# Vivado block design bd_afc3, xczu48dr-ffvg1517-2-e, Vivado 2024.1
# (continued, part 5 of 22)
current_bd_instance /s00_entry_pipeline
set_property -dict [list \
  CONFIG.ADDR_WIDTH 40 \
  CONFIG.ENABLE_PIPELINING 0 \
  CONFIG.ID_WIDTH 16 \
  CONFIG.IS_CASCADED 0 \
  CONFIG.MSC000_ROUTE 0b1000000100000001 \
  CONFIG.MSC001_ROUTE 0b1000001000000001 \
  CONFIG.MSC002_ROUTE 0b1000010000000001 \
  CONFIG.MSC003_ROUTE 0b1000100000000001 \
  CONFIG.MSC004_ROUTE 0b1001000000000001 \
  CONFIG.MSC005_ROUTE 0b1010000000000001 \
  CONFIG.MSC006_ROUTE 0b1100000000000001 \
  CONFIG.MSC007_ROUTE 0b1000000100000010 \
  CONFIG.MSC008_ROUTE 0b1000001000000010 \
  CONFIG.MSC009_ROUTE 0b1000010000000010 \
  CONFIG.MSC010_ROUTE 0b1000100000000010 \
  CONFIG.MSC011_ROUTE 0b1001000000000010 \
  CONFIG.MSC012_ROUTE 0b1010000000000010 \
  CONFIG.MSC013_ROUTE 0b1100000000000010 \
  CONFIG.MSC014_ROUTE 0b1000000100000100 \
  CONFIG.MSC015_ROUTE 0b1000001000000100 \
  CONFIG.MSC016_ROUTE 0b1000010000000100 \
  CONFIG.MSC017_ROUTE 0b1000100000000100 \
  CONFIG.MSC018_ROUTE 0b1001000000000100 \
  CONFIG.MSC019_ROUTE 0b1010000000000100 \
  CONFIG.MSC020_ROUTE 0b1100000000000100 \
  CONFIG.MSC021_ROUTE 0b1000000100001000 \
  CONFIG.MSC022_ROUTE 0b1000001000001000 \
  CONFIG.MSC023_ROUTE 0b1000010000001000 \
  CONFIG.MSC024_ROUTE 0b1000100000001000 \
  CONFIG.MSC025_ROUTE 0b1001000000001000 \
  CONFIG.MSC026_ROUTE 0b1010000000001000 \
  CONFIG.MSC027_ROUTE 0b1000000100010000 \
  CONFIG.MSC028_ROUTE 0b1000001000010000 \
  CONFIG.MSC029_ROUTE 0b1000010000010000 \
  CONFIG.MSC030_ROUTE 0b1000100000010000 \
  CONFIG.MSC031_ROUTE 0b1001000000010000 \
  CONFIG.MSC032_ROUTE 0b1010000000010000 \
  CONFIG.MSC033_ROUTE 0b1000000100100000 \
  CONFIG.MSC034_ROUTE 0b1000001000100000 \
  CONFIG.MSC035_ROUTE 0b1000010000100000 \
  CONFIG.MSC036_ROUTE 0b1000100000100000 \
  CONFIG.MSC037_ROUTE 0b1001000000100000 \
  CONFIG.MSC038_ROUTE 0b1010000000100000 \
  CONFIG.MSC039_ROUTE 0b1000000101000000 \
  CONFIG.MSC040_ROUTE 0b1000001001000000 \
  CONFIG.MSC041_ROUTE 0b1000010001000000 \
  CONFIG.MSC042_ROUTE 0b1000100001000000 \
  CONFIG.MSC043_ROUTE 0b1001000001000000 \
  CONFIG.MSC044_ROUTE 0b1010000001000000 \
  CONFIG.MSC045_ROUTE 0b1000000110000000 \
  CONFIG.MSC046_ROUTE 0b1000001010000000 \
  CONFIG.MSC047_ROUTE 0b1000010010000000 \
  CONFIG.MSC048_ROUTE 0b1000100010000000 \
  CONFIG.MSC049_ROUTE 0b1001000010000000 \
  CONFIG.MSC050_ROUTE 0b1010000010000000 \
  CONFIG.MSC_ROUTE_WIDTH 16 \
  CONFIG.NUM_MSC 51 \
  CONFIG.NUM_READ_OUTSTANDING 8 \
  CONFIG.NUM_SEG 51 \
  CONFIG.NUM_WRITE_OUTSTANDING 8 \
  CONFIG.RDATA_WIDTH 32 \
  CONFIG.READ_WRITE_MODE READ_WRITE \
  CONFIG.SEG000_BASE_ADDR 0x0000000080000000 \
  CONFIG.SEG000_SECURE_READ 0 \
  CONFIG.SEG000_SECURE_WRITE 0 \
  CONFIG.SEG000_SEP_ROUTE 0b0000000000000000000000000000000000000000000000000000000000000000 \
  CONFIG.SEG000_SIZE 13 \
  CONFIG.SEG000_SUPPORTS_READ 1 \
  CONFIG.SEG000_SUPPORTS_WRITE 1 \
  CONFIG.SEG001_BASE_ADDR 0x0000000080010000 \
  CONFIG.SEG001_SECURE_READ 0 \
  CONFIG.SEG001_SECURE_WRITE 0 \
  CONFIG.SEG001_SEP_ROUTE 0b0000000000000000000000000000000000000000000000000000000000001100 \
  CONFIG.SEG001_SIZE 16 \
  CONFIG.SEG001_SUPPORTS_READ 1 \
  CONFIG.SEG001_SUPPORTS_WRITE 1 \
  CONFIG.SEG002_BASE_ADDR 0x0000000080020000 \
  CONFIG.SEG002_SECURE_READ 0 \
  CONFIG.SEG002_SECURE_WRITE 0 \
  CONFIG.SEG002_SEP_ROUTE 0b0000000000000000000000000000000000000000000000000000000000001101 \
  CONFIG.SEG002_SIZE 16 \
  CONFIG.SEG002_SUPPORTS_READ 1 \
  CONFIG.SEG002_SUPPORTS_WRITE 1 \
  CONFIG.SEG003_BASE_ADDR 0x0000000080030000 \
  CONFIG.SEG003_SECURE_READ 0 \
  CONFIG.SEG003_SECURE_WRITE 0 \
  CONFIG.SEG003_SEP_ROUTE 0b0000000000000000000000000000000000000000000000000000000000001110 \
  CONFIG.SEG003_SIZE 16 \
  CONFIG.SEG003_SUPPORTS_READ 1 \
  CONFIG.SEG003_SUPPORTS_WRITE 1 \
  CONFIG.SEG004_BASE_ADDR 0x0000000080040000 \
  CONFIG.SEG004_SECURE_READ 0 \
  CONFIG.SEG004_SECURE_WRITE 0 \
  CONFIG.SEG004_SEP_ROUTE 0b0000000000000000000000000000000000000000000000000000000000001111 \
  CONFIG.SEG004_SIZE 16 \
  CONFIG.SEG004_SUPPORTS_READ 1 \
  CONFIG.SEG004_SUPPORTS_WRITE 1 \
  CONFIG.SEG005_BASE_ADDR 0x0000000080050000 \
  CONFIG.SEG005_SECURE_READ 0 \
  CONFIG.SEG005_SECURE_WRITE 0 \
  CONFIG.SEG005_SEP_ROUTE 0b0000000000000000000000000000000000000000000000000000000000010000 \
  CONFIG.SEG005_SIZE 16 \
  CONFIG.SEG005_SUPPORTS_READ 1 \
  CONFIG.SEG005_SUPPORTS_WRITE 1 \
  CONFIG.SEG006_BASE_ADDR 0x0000000080060000 \
  CONFIG.SEG006_SECURE_READ 0 \
  CONFIG.SEG006_SECURE_WRITE 0 \
  CONFIG.SEG006_SEP_ROUTE 0b0000000000000000000000000000000000000000000000000000000000010001 \
  CONFIG.SEG006_SIZE 16 \
  CONFIG.SEG006_SUPPORTS_READ 1 \
  CONFIG.SEG006_SUPPORTS_WRITE 1 \
  CONFIG.SEG007_BASE_ADDR 0x0000000080070000 \
  CONFIG.SEG007_SECURE_READ 0 \
  CONFIG.SEG007_SECURE_WRITE 0 \
  CONFIG.SEG007_SEP_ROUTE 0b0000000000000000000000000000000000000000000000000000000000010010 \
  CONFIG.SEG007_SIZE 16 \
  CONFIG.SEG007_SUPPORTS_READ 1 \
  CONFIG.SEG007_SUPPORTS_WRITE 1 \
  CONFIG.SEG008_BASE_ADDR 0x0000000080080000 \
  CONFIG.SEG008_SECURE_READ 0 \
  CONFIG.SEG008_SECURE_WRITE 0 \
  CONFIG.SEG008_SEP_ROUTE 0b0000000000000000000000000000000000000000000000000000000000010011 \
  CONFIG.SEG008_SIZE 16 \
  CONFIG.SEG008_SUPPORTS_READ 1 \
  CONFIG.SEG008_SUPPORTS_WRITE 1 \
  CONFIG.SEG009_BASE_ADDR 0x0000000080090000 \
  CONFIG.SEG009_SECURE_READ 0 \
  CONFIG.SEG009_SECURE_WRITE 0 \
  CONFIG.SEG009_SEP_ROUTE 0b0000000000000000000000000000000000000000000000000000000000010100 \
  CONFIG.SEG009_SIZE 16 \
  CONFIG.SEG009_SUPPORTS_READ 1 \
  CONFIG.SEG009_SUPPORTS_WRITE 1 \
  CONFIG.SEG010_BASE_ADDR 0x00000000800A0000 \
  CONFIG.SEG010_SECURE_READ 0 \
  CONFIG.SEG010_SECURE_WRITE 0 \
  CONFIG.SEG010_SEP_ROUTE 0b0000000000000000000000000000000000000000000000000000000000010101 \
  CONFIG.SEG010_SIZE 16 \
  CONFIG.SEG010_SUPPORTS_READ 1 \
  CONFIG.SEG010_SUPPORTS_WRITE 1 \
  CONFIG.SEG011_BASE_ADDR 0x00000000800B0000 \
  CONFIG.SEG011_SECURE_READ 0 \
  CONFIG.SEG011_SECURE_WRITE 0 \
  CONFIG.SEG011_SEP_ROUTE 0b0000000000000000000000000000000000000000000000000000000000010110 \
  CONFIG.SEG011_SIZE 16 \
  CONFIG.SEG011_SUPPORTS_READ 1 \
  CONFIG.SEG011_SUPPORTS_WRITE 1 \
  CONFIG.SEG012_BASE_ADDR 0x00000000800C0000 \
  CONFIG.SEG012_SECURE_READ 0 \
  CONFIG.SEG012_SECURE_WRITE 0 \
  CONFIG.SEG012_SEP_ROUTE 0b0000000000000000000000000000000000000000000000000000000000010111 \
  CONFIG.SEG012_SIZE 16 \
  CONFIG.SEG012_SUPPORTS_READ 1 \
  CONFIG.SEG012_SUPPORTS_WRITE 1 \
  CONFIG.SEG013_BASE_ADDR 0x00000000800D0000 \
  CONFIG.SEG013_SECURE_READ 0 \
  CONFIG.SEG013_SECURE_WRITE 0 \
  CONFIG.SEG013_SEP_ROUTE 0b0000000000000000000000000000000000000000000000000000000000011000 \
  CONFIG.SEG013_SIZE 16 \
  CONFIG.SEG013_SUPPORTS_READ 1 \
  CONFIG.SEG013_SUPPORTS_WRITE 1 \
  CONFIG.SEG014_BASE_ADDR 0x00000000800E0000 \
  CONFIG.SEG014_SECURE_READ 0 \
  CONFIG.SEG014_SECURE_WRITE 0 \
  CONFIG.SEG014_SEP_ROUTE 0b0000000000000000000000000000000000000000000000000000000000011001 \
  CONFIG.SEG014_SIZE 16 \
  CONFIG.SEG014_SUPPORTS_READ 1 \
  CONFIG.SEG014_SUPPORTS_WRITE 1 \
  CONFIG.SEG015_BASE_ADDR 0x00000000800F0000 \
  CONFIG.SEG015_SECURE_READ 0 \
  CONFIG.SEG015_SECURE_WRITE 0 \
  CONFIG.SEG015_SEP_ROUTE 0b0000000000000000000000000000000000000000000000000000000000011010 \
  CONFIG.SEG015_SIZE 16 \
  CONFIG.SEG015_SUPPORTS_READ 1 \
  CONFIG.SEG015_SUPPORTS_WRITE 1 \
  CONFIG.SEG016_BASE_ADDR 0x0000000080100000 \
  CONFIG.SEG016_SECURE_READ 0 \
  CONFIG.SEG016_SECURE_WRITE 0 \
  CONFIG.SEG016_SEP_ROUTE 0b0000000000000000000000000000000000000000000000000000000000011011 \
  CONFIG.SEG016_SIZE 16 \
  CONFIG.SEG016_SUPPORTS_READ 1 \
  CONFIG.SEG016_SUPPORTS_WRITE 1 \
  CONFIG.SEG017_BASE_ADDR 0x0000000080110000 \
  CONFIG.SEG017_SECURE_READ 0 \
  CONFIG.SEG017_SECURE_WRITE 0 \
  CONFIG.SEG017_SEP_ROUTE 0b0000000000000000000000000000000000000000000000000000000000011100 \
  CONFIG.SEG017_SIZE 16 \
  CONFIG.SEG017_SUPPORTS_READ 1 \
  CONFIG.SEG017_SUPPORTS_WRITE 1 \
  CONFIG.SEG018_BASE_ADDR 0x0000000080120000 \
  CONFIG.SEG018_SECURE_READ 0 \
  CONFIG.SEG018_SECURE_WRITE 0 \
  CONFIG.SEG018_SEP_ROUTE 0b0000000000000000000000000000000000000000000000000000000000011101 \
  CONFIG.SEG018_SIZE 16 \
  CONFIG.SEG018_SUPPORTS_READ 1 \
  CONFIG.SEG018_SUPPORTS_WRITE 1 \
  CONFIG.SEG019_BASE_ADDR 0x0000000080130000 \
  CONFIG.SEG019_SECURE_READ 0 \
  CONFIG.SEG019_SECURE_WRITE 0 \
  CONFIG.SEG019_SEP_ROUTE 0b0000000000000000000000000000000000000000000000000000000000011110 \
  CONFIG.SEG019_SIZE 16 \
  CONFIG.SEG019_SUPPORTS_READ 1 \
  CONFIG.SEG019_SUPPORTS_WRITE 1 \
  CONFIG.SEG020_BASE_ADDR 0x0000000080140000 \
  CONFIG.SEG020_SECURE_READ 0 \
  CONFIG.SEG020_SECURE_WRITE 0 \
  CONFIG.SEG020_SEP_ROUTE 0b0000000000000000000000000000000000000000000000000000000000011111 \
  CONFIG.SEG020_SIZE 16 \
  CONFIG.SEG020_SUPPORTS_READ 1 \
  CONFIG.SEG020_SUPPORTS_WRITE 1 \
  CONFIG.SEG021_BASE_ADDR 0x0000000080150000 \
  CONFIG.SEG021_SECURE_READ 0 \
  CONFIG.SEG021_SECURE_WRITE 0 \
  CONFIG.SEG021_SEP_ROUTE 0b0000000000000000000000000000000000000000000000000000000000100000 \
  CONFIG.SEG021_SIZE 16 \
  CONFIG.SEG021_SUPPORTS_READ 1 \
  CONFIG.SEG021_SUPPORTS_WRITE 1 \
  CONFIG.SEG022_BASE_ADDR 0x0000000080160000 \
  CONFIG.SEG022_SECURE_READ 0 \
  CONFIG.SEG022_SECURE_WRITE 0 \
  CONFIG.SEG022_SEP_ROUTE 0b0000000000000000000000000000000000000000000000000000000000100001 \
  CONFIG.SEG022_SIZE 16 \
  CONFIG.SEG022_SUPPORTS_READ 1 \
  CONFIG.SEG022_SUPPORTS_WRITE 1 \
  CONFIG.SEG023_BASE_ADDR 0x0000000080170000 \
  CONFIG.SEG023_SECURE_READ 0 \
  CONFIG.SEG023_SECURE_WRITE 0 \
  CONFIG.SEG023_SEP_ROUTE 0b0000000000000000000000000000000000000000000000000000000000100010 \
  CONFIG.SEG023_SIZE 16 \
  CONFIG.SEG023_SUPPORTS_READ 1 \
  CONFIG.SEG023_SUPPORTS_WRITE 1 \
  CONFIG.SEG024_BASE_ADDR 0x0000000080180000 \
  CONFIG.SEG024_SECURE_READ 0 \
  CONFIG.SEG024_SECURE_WRITE 0 \
  CONFIG.SEG024_SEP_ROUTE 0b0000000000000000000000000000000000000000000000000000000000100011 \
  CONFIG.SEG024_SIZE 16 \
  CONFIG.SEG024_SUPPORTS_READ 1 \
  CONFIG.SEG024_SUPPORTS_WRITE 1 \
  CONFIG.SEG025_BASE_ADDR 0x0000000080190000 \
  CONFIG.SEG025_SECURE_READ 0 \
  CONFIG.SEG025_SECURE_WRITE 0 \
  CONFIG.SEG025_SEP_ROUTE 0b0000000000000000000000000000000000000000000000000000000000100100 \
  CONFIG.SEG025_SIZE 16 \
  CONFIG.SEG025_SUPPORTS_READ 1 \
  CONFIG.SEG025_SUPPORTS_WRITE 1 \
  CONFIG.SEG026_BASE_ADDR 0x00000000801A0000 \
  CONFIG.SEG026_SECURE_READ 0 \
  CONFIG.SEG026_SECURE_WRITE 0 \
  CONFIG.SEG026_SEP_ROUTE 0b0000000000000000000000000000000000000000000000000000000000100101 \
  CONFIG.SEG026_SIZE 16 \
  CONFIG.SEG026_SUPPORTS_READ 1 \
  CONFIG.SEG026_SUPPORTS_WRITE 1 \
  CONFIG.SEG027_BASE_ADDR 0x00000000801B0000 \
  CONFIG.SEG027_SECURE_READ 0 \
  CONFIG.SEG027_SECURE_WRITE 0 \
  CONFIG.SEG027_SEP_ROUTE 0b0000000000000000000000000000000000000000000000000000000000100110 \
  CONFIG.SEG027_SIZE 16 \
  CONFIG.SEG027_SUPPORTS_READ 1 \
  CONFIG.SEG027_SUPPORTS_WRITE 1 \
  CONFIG.SEG028_BASE_ADDR 0x00000000801C0000 \
  CONFIG.SEG028_SECURE_READ 0 \
  CONFIG.SEG028_SECURE_WRITE 0 \
  CONFIG.SEG028_SEP_ROUTE 0b0000000000000000000000000000000000000000000000000000000000100111 \
  CONFIG.SEG028_SIZE 16 \
  CONFIG.SEG028_SUPPORTS_READ 1 \
  CONFIG.SEG028_SUPPORTS_WRITE 1 \
  CONFIG.SEG029_BASE_ADDR 0x00000000801D0000 \
  CONFIG.SEG029_SECURE_READ 0 \
  CONFIG.SEG029_SECURE_WRITE 0 \
  CONFIG.SEG029_SEP_ROUTE 0b0000000000000000000000000000000000000000000000000000000000101000 \
  CONFIG.SEG029_SIZE 16 \
  CONFIG.SEG029_SUPPORTS_READ 1 \
  CONFIG.SEG029_SUPPORTS_WRITE 1 \
  CONFIG.SEG030_BASE_ADDR 0x00000000801E0000 \
  CONFIG.SEG030_SECURE_READ 0 \
  CONFIG.SEG030_SECURE_WRITE 0 \
  CONFIG.SEG030_SEP_ROUTE 0b0000000000000000000000000000000000000000000000000000000000101001 \
  CONFIG.SEG030_SIZE 16 \
  CONFIG.SEG030_SUPPORTS_READ 1 \
  CONFIG.SEG030_SUPPORTS_WRITE 1 \
  CONFIG.SEG031_BASE_ADDR 0x00000000801F0000 \
  CONFIG.SEG031_SECURE_READ 0 \
  CONFIG.SEG031_SECURE_WRITE 0 \
  CONFIG.SEG031_SEP_ROUTE 0b0000000000000000000000000000000000000000000000000000000000101010 \
  CONFIG.SEG031_SIZE 16 \
  CONFIG.SEG031_SUPPORTS_READ 1 \
  CONFIG.SEG031_SUPPORTS_WRITE 1 \
  CONFIG.SEG032_BASE_ADDR 0x0000000080200000 \
  CONFIG.SEG032_SECURE_READ 0 \
  CONFIG.SEG032_SECURE_WRITE 0 \
  CONFIG.SEG032_SEP_ROUTE 0b0000000000000000000000000000000000000000000000000000000000101011 \
  CONFIG.SEG032_SIZE 16 \
  CONFIG.SEG032_SUPPORTS_READ 1 \
  CONFIG.SEG032_SUPPORTS_WRITE 1 \
  CONFIG.SEG033_BASE_ADDR 0x0000000080210000 \
  CONFIG.SEG033_SECURE_READ 0 \
  CONFIG.SEG033_SECURE_WRITE 0 \
  CONFIG.SEG033_SEP_ROUTE 0b0000000000000000000000000000000000000000000000000000000000101100 \
  CONFIG.SEG033_SIZE 16 \
  CONFIG.SEG033_SUPPORTS_READ 1 \
  CONFIG.SEG033_SUPPORTS_WRITE 1 \
  CONFIG.SEG034_BASE_ADDR 0x0000000080220000 \
  CONFIG.SEG034_SECURE_READ 0 \
  CONFIG.SEG034_SECURE_WRITE 0 \
  CONFIG.SEG034_SEP_ROUTE 0b0000000000000000000000000000000000000000000000000000000000101101 \
  CONFIG.SEG034_SIZE 16 \
  CONFIG.SEG034_SUPPORTS_READ 1 \
  CONFIG.SEG034_SUPPORTS_WRITE 1 \
  CONFIG.SEG035_BASE_ADDR 0x0000000080230000 \
  CONFIG.SEG035_SECURE_READ 0 \
  CONFIG.SEG035_SECURE_WRITE 0 \
  CONFIG.SEG035_SEP_ROUTE 0b0000000000000000000000000000000000000000000000000000000000101110 \
  CONFIG.SEG035_SIZE 16 \
  CONFIG.SEG035_SUPPORTS_READ 1 \
  CONFIG.SEG035_SUPPORTS_WRITE 1 \
  CONFIG.SEG036_BASE_ADDR 0x0000000080240000 \
  CONFIG.SEG036_SECURE_READ 0 \
  CONFIG.SEG036_SECURE_WRITE 0 \
  CONFIG.SEG036_SEP_ROUTE 0b0000000000000000000000000000000000000000000000000000000000101111 \
  CONFIG.SEG036_SIZE 16 \
  CONFIG.SEG036_SUPPORTS_READ 1 \
  CONFIG.SEG036_SUPPORTS_WRITE 1 \
  CONFIG.SEG037_BASE_ADDR 0x0000000080250000 \
  CONFIG.SEG037_SECURE_READ 0 \
  CONFIG.SEG037_SECURE_WRITE 0 \
  CONFIG.SEG037_SEP_ROUTE 0b0000000000000000000000000000000000000000000000000000000000110000 \
  CONFIG.SEG037_SIZE 16 \
  CONFIG.SEG037_SUPPORTS_READ 1 \
  CONFIG.SEG037_SUPPORTS_WRITE 1 \
  CONFIG.SEG038_BASE_ADDR 0x0000000080260000 \
  CONFIG.SEG038_SECURE_READ 0 \
  CONFIG.SEG038_SECURE_WRITE 0 \
  CONFIG.SEG038_SEP_ROUTE 0b0000000000000000000000000000000000000000000000000000000000110001 \
  CONFIG.SEG038_SIZE 16 \
  CONFIG.SEG038_SUPPORTS_READ 1 \
  CONFIG.SEG038_SUPPORTS_WRITE 1 \
  CONFIG.SEG039_BASE_ADDR 0x0000000080270000 \
  CONFIG.SEG039_SECURE_READ 0 \
  CONFIG.SEG039_SECURE_WRITE 0 \
  CONFIG.SEG039_SEP_ROUTE 0b0000000000000000000000000000000000000000000000000000000000110010 \
  CONFIG.SEG039_SIZE 16 \
  CONFIG.SEG039_SUPPORTS_READ 1 \
  CONFIG.SEG039_SUPPORTS_WRITE 1 \
  CONFIG.SEG040_BASE_ADDR 0x0000000082000000 \
  CONFIG.SEG040_SECURE_READ 0 \
  CONFIG.SEG040_SECURE_WRITE 0 \
  CONFIG.SEG040_SEP_ROUTE 0b0000000000000000000000000000000000000000000000000000000000000001 \
  CONFIG.SEG040_SIZE 13 \
  CONFIG.SEG040_SUPPORTS_READ 1 \
  CONFIG.SEG040_SUPPORTS_WRITE 1 \
  CONFIG.SEG041_BASE_ADDR 0x0000000084000000 \
  CONFIG.SEG041_SECURE_READ 0 \
  CONFIG.SEG041_SECURE_WRITE 0 \
  CONFIG.SEG041_SEP_ROUTE 0b0000000000000000000000000000000000000000000000000000000000000010 \
  CONFIG.SEG041_SIZE 13 \
  CONFIG.SEG041_SUPPORTS_READ 1 \
  CONFIG.SEG041_SUPPORTS_WRITE 1 \
  CONFIG.SEG042_BASE_ADDR 0x0000000086000000 \
  CONFIG.SEG042_SECURE_READ 0 \
  CONFIG.SEG042_SECURE_WRITE 0 \
  CONFIG.SEG042_SEP_ROUTE 0b0000000000000000000000000000000000000000000000000000000000000011 \
  CONFIG.SEG042_SIZE 13 \
  CONFIG.SEG042_SUPPORTS_READ 1 \
  CONFIG.SEG042_SUPPORTS_WRITE 1 \
  CONFIG.SEG043_BASE_ADDR 0x0000000088000000 \
  CONFIG.SEG043_SECURE_READ 0 \
  CONFIG.SEG043_SECURE_WRITE 0 \
  CONFIG.SEG043_SEP_ROUTE 0b0000000000000000000000000000000000000000000000000000000000000100 \
  CONFIG.SEG043_SIZE 13 \
  CONFIG.SEG043_SUPPORTS_READ 1 \
  CONFIG.SEG043_SUPPORTS_WRITE 1 \
  CONFIG.SEG044_BASE_ADDR 0x000000008A000000 \
  CONFIG.SEG044_SECURE_READ 0 \
  CONFIG.SEG044_SECURE_WRITE 0 \
  CONFIG.SEG044_SEP_ROUTE 0b0000000000000000000000000000000000000000000000000000000000000101 \
  CONFIG.SEG044_SIZE 13 \
  CONFIG.SEG044_SUPPORTS_READ 1 \
  CONFIG.SEG044_SUPPORTS_WRITE 1 \
  CONFIG.SEG045_BASE_ADDR 0x000000008C000000 \
  CONFIG.SEG045_SECURE_READ 0 \
  CONFIG.SEG045_SECURE_WRITE 0 \
  CONFIG.SEG045_SEP_ROUTE 0b0000000000000000000000000000000000000000000000000000000000000110 \
  CONFIG.SEG045_SIZE 13 \
  CONFIG.SEG045_SUPPORTS_READ 1 \
  CONFIG.SEG045_SUPPORTS_WRITE 1 \
  CONFIG.SEG046_BASE_ADDR 0x000000008E000000 \
  CONFIG.SEG046_SECURE_READ 0 \
  CONFIG.SEG046_SECURE_WRITE 0 \
  CONFIG.SEG046_SEP_ROUTE 0b0000000000000000000000000000000000000000000000000000000000000111 \
  CONFIG.SEG046_SIZE 13 \
  CONFIG.SEG046_SUPPORTS_READ 1 \
  CONFIG.SEG046_SUPPORTS_WRITE 1 \
  CONFIG.SEG047_BASE_ADDR 0x0000000090000000 \
  CONFIG.SEG047_SECURE_READ 0 \
  CONFIG.SEG047_SECURE_WRITE 0 \
  CONFIG.SEG047_SEP_ROUTE 0b0000000000000000000000000000000000000000000000000000000000001000 \
  CONFIG.SEG047_SIZE 13 \
  CONFIG.SEG047_SUPPORTS_READ 1 \
  CONFIG.SEG047_SUPPORTS_WRITE 1 \
  CONFIG.SEG048_BASE_ADDR 0x0000000092000000 \
  CONFIG.SEG048_SECURE_READ 0 \
  CONFIG.SEG048_SECURE_WRITE 0 \
  CONFIG.SEG048_SEP_ROUTE 0b0000000000000000000000000000000000000000000000000000000000001001 \
  CONFIG.SEG048_SIZE 13 \
  CONFIG.SEG048_SUPPORTS_READ 1 \
  CONFIG.SEG048_SUPPORTS_WRITE 1 \
  CONFIG.SEG049_BASE_ADDR 0x0000000094000000 \
  CONFIG.SEG049_SECURE_READ 0 \
  CONFIG.SEG049_SECURE_WRITE 0 \
  CONFIG.SEG049_SEP_ROUTE 0b0000000000000000000000000000000000000000000000000000000000001010 \
  CONFIG.SEG049_SIZE 13 \
  CONFIG.SEG049_SUPPORTS_READ 1 \
  CONFIG.SEG049_SUPPORTS_WRITE 1 \
  CONFIG.SEG050_BASE_ADDR 0x0000000096000000 \
  CONFIG.SEG050_SECURE_READ 0 \
  CONFIG.SEG050_SECURE_WRITE 0 \
  CONFIG.SEG050_SEP_ROUTE 0b0000000000000000000000000000000000000000000000000000000000001011 \
  CONFIG.SEG050_SIZE 13 \
  CONFIG.SEG050_SUPPORTS_READ 1 \
  CONFIG.SEG050_SUPPORTS_WRITE 1 \
  CONFIG.SINGLE_ISSUING 1 \
  CONFIG.SUPPORTS_NARROW 1 \
  CONFIG.SUPPORTS_WRAP 0 \
  CONFIG.S_ARUSER_WIDTH 16 \
  CONFIG.S_AWUSER_WIDTH 16 \
  CONFIG.S_BUSER_WIDTH 0 \
  CONFIG.S_PROTOCOL AXI4 \
  CONFIG.S_RUSER_WIDTH 0 \
  CONFIG.S_WUSER_WIDTH 0 \
  CONFIG.WDATA_WIDTH 32 \
] [get_bd_cells s00_mmu]
create_bd_cell -type ip -vlnv xilinx.com:ip:sc_transaction_regulator:1.0 s00_transaction_regulator
set_property -dict [list \
  CONFIG.ADDR_WIDTH 40 \
  CONFIG.IS_CASCADED 0 \
  CONFIG.MEP_IDENTIFIER 1 \
  CONFIG.MEP_IDENTIFIER_WIDTH 1 \
  CONFIG.NUM_READ_OUTSTANDING 8 \
  CONFIG.NUM_READ_THREADS 1 \
  CONFIG.NUM_WRITE_OUTSTANDING 8 \
  CONFIG.NUM_WRITE_THREADS 1 \
  CONFIG.RDATA_WIDTH 32 \
  CONFIG.READ_WRITE_MODE READ_WRITE \
  CONFIG.SEP_ROUTE_WIDTH 6 \
  CONFIG.SINGLE_ISSUING 1 \
  CONFIG.SUPPORTS_READ_DEADLOCK 0 \
  CONFIG.SUPPORTS_WRITE_DEADLOCK 0 \
  CONFIG.S_ID_WIDTH 16 \
  CONFIG.WDATA_WIDTH 32 \
] [get_bd_cells s00_transaction_regulator]
create_bd_cell -type ip -vlnv xilinx.com:ip:sc_si_converter:1.0 s00_si_converter
set_property -dict [list \
  CONFIG.ADDR_WIDTH 40 \
  CONFIG.AXILITE_CONV 1 \
  CONFIG.HAS_BURST 1 \
  CONFIG.ID_WIDTH 3 \
  CONFIG.IS_CASCADED 0 \
  CONFIG.LIMIT_READ_LENGTH 0 \
  CONFIG.LIMIT_WRITE_LENGTH 0 \
  CONFIG.MAX_RUSER_BITS_PER_BYTE 0 \
  CONFIG.MAX_WUSER_BITS_PER_BYTE 0 \
  CONFIG.MEP_IDENTIFIER_WIDTH 1 \
  CONFIG.MSC000_RDATA_WIDTH 32 \
  CONFIG.MSC000_WDATA_WIDTH 32 \
  CONFIG.MSC001_RDATA_WIDTH 32 \
  CONFIG.MSC001_WDATA_WIDTH 32 \
  CONFIG.MSC002_RDATA_WIDTH 32 \
  CONFIG.MSC002_WDATA_WIDTH 32 \
  CONFIG.MSC003_RDATA_WIDTH 32 \
  CONFIG.MSC003_WDATA_WIDTH 32 \
  CONFIG.MSC004_RDATA_WIDTH 32 \
  CONFIG.MSC004_WDATA_WIDTH 32 \
  CONFIG.MSC005_RDATA_WIDTH 32 \
  CONFIG.MSC005_WDATA_WIDTH 32 \
  CONFIG.MSC006_RDATA_WIDTH 32 \
  CONFIG.MSC006_WDATA_WIDTH 32 \
  CONFIG.MSC007_RDATA_WIDTH 32 \
  CONFIG.MSC007_WDATA_WIDTH 32 \
  CONFIG.MSC008_RDATA_WIDTH 32 \
  CONFIG.MSC008_WDATA_WIDTH 32 \
  CONFIG.MSC009_RDATA_WIDTH 32 \
  CONFIG.MSC009_WDATA_WIDTH 32 \
  CONFIG.MSC010_RDATA_WIDTH 32 \
  CONFIG.MSC010_WDATA_WIDTH 32 \
  CONFIG.MSC011_RDATA_WIDTH 32 \
  CONFIG.MSC011_WDATA_WIDTH 32 \
  CONFIG.MSC012_RDATA_WIDTH 32 \
  CONFIG.MSC012_WDATA_WIDTH 32 \
  CONFIG.MSC013_RDATA_WIDTH 32 \
  CONFIG.MSC013_WDATA_WIDTH 32 \
  CONFIG.MSC014_RDATA_WIDTH 32 \
  CONFIG.MSC014_WDATA_WIDTH 32 \
  CONFIG.MSC015_RDATA_WIDTH 32 \
  CONFIG.MSC015_WDATA_WIDTH 32 \
  CONFIG.MSC016_RDATA_WIDTH 32 \
  CONFIG.MSC016_WDATA_WIDTH 32 \
  CONFIG.MSC017_RDATA_WIDTH 32 \
  CONFIG.MSC017_WDATA_WIDTH 32 \
  CONFIG.MSC018_RDATA_WIDTH 32 \
  CONFIG.MSC018_WDATA_WIDTH 32 \
  CONFIG.MSC019_RDATA_WIDTH 32 \
  CONFIG.MSC019_WDATA_WIDTH 32 \
  CONFIG.MSC020_RDATA_WIDTH 32 \
  CONFIG.MSC020_WDATA_WIDTH 32 \
  CONFIG.MSC021_RDATA_WIDTH 32 \
  CONFIG.MSC021_WDATA_WIDTH 32 \
  CONFIG.MSC022_RDATA_WIDTH 32 \
  CONFIG.MSC022_WDATA_WIDTH 32 \
  CONFIG.MSC023_RDATA_WIDTH 32 \
  CONFIG.MSC023_WDATA_WIDTH 32 \
  CONFIG.MSC024_RDATA_WIDTH 32 \
  CONFIG.MSC024_WDATA_WIDTH 32 \
  CONFIG.MSC025_RDATA_WIDTH 32 \
  CONFIG.MSC025_WDATA_WIDTH 32 \
  CONFIG.MSC026_RDATA_WIDTH 32 \
  CONFIG.MSC026_WDATA_WIDTH 32 \
  CONFIG.MSC027_RDATA_WIDTH 32 \
  CONFIG.MSC027_WDATA_WIDTH 32 \
  CONFIG.MSC028_RDATA_WIDTH 32 \
  CONFIG.MSC028_WDATA_WIDTH 32 \
  CONFIG.MSC029_RDATA_WIDTH 32 \
  CONFIG.MSC029_WDATA_WIDTH 32 \
  CONFIG.MSC030_RDATA_WIDTH 32 \
  CONFIG.MSC030_WDATA_WIDTH 32 \
  CONFIG.MSC031_RDATA_WIDTH 32 \
  CONFIG.MSC031_WDATA_WIDTH 32 \
  CONFIG.MSC032_RDATA_WIDTH 32 \
  CONFIG.MSC032_WDATA_WIDTH 32 \
  CONFIG.MSC033_RDATA_WIDTH 32 \
  CONFIG.MSC033_WDATA_WIDTH 32 \
  CONFIG.MSC034_RDATA_WIDTH 32 \
  CONFIG.MSC034_WDATA_WIDTH 32 \
  CONFIG.MSC035_RDATA_WIDTH 32 \
  CONFIG.MSC035_WDATA_WIDTH 32 \
  CONFIG.MSC036_RDATA_WIDTH 32 \
  CONFIG.MSC036_WDATA_WIDTH 32 \
  CONFIG.MSC037_RDATA_WIDTH 32 \
  CONFIG.MSC037_WDATA_WIDTH 32 \
  CONFIG.MSC038_RDATA_WIDTH 32 \
  CONFIG.MSC038_WDATA_WIDTH 32 \
  CONFIG.MSC039_RDATA_WIDTH 32 \
  CONFIG.MSC039_WDATA_WIDTH 32 \
  CONFIG.MSC040_RDATA_WIDTH 32 \
  CONFIG.MSC040_WDATA_WIDTH 32 \
  CONFIG.MSC041_RDATA_WIDTH 32 \
  CONFIG.MSC041_WDATA_WIDTH 32 \
  CONFIG.MSC042_RDATA_WIDTH 32 \
  CONFIG.MSC042_WDATA_WIDTH 32 \
  CONFIG.MSC043_RDATA_WIDTH 32 \
  CONFIG.MSC043_WDATA_WIDTH 32 \
  CONFIG.MSC044_RDATA_WIDTH 32 \
  CONFIG.MSC044_WDATA_WIDTH 32 \
  CONFIG.MSC045_RDATA_WIDTH 32 \
  CONFIG.MSC045_WDATA_WIDTH 32 \
  CONFIG.MSC046_RDATA_WIDTH 32 \
  CONFIG.MSC046_WDATA_WIDTH 32 \
  CONFIG.MSC047_RDATA_WIDTH 32 \
  CONFIG.MSC047_WDATA_WIDTH 32 \
  CONFIG.MSC048_RDATA_WIDTH 32 \
  CONFIG.MSC048_WDATA_WIDTH 32 \
  CONFIG.MSC049_RDATA_WIDTH 32 \
  CONFIG.MSC049_WDATA_WIDTH 32 \
  CONFIG.MSC050_RDATA_WIDTH 32 \
  CONFIG.MSC050_WDATA_WIDTH 32 \
  CONFIG.NUM_MSC 51 \
  CONFIG.NUM_READ_OUTSTANDING 8 \
  CONFIG.NUM_READ_THREADS 1 \
  CONFIG.NUM_SEG 51 \
  CONFIG.NUM_WRITE_OUTSTANDING 8 \
  CONFIG.NUM_WRITE_THREADS 1 \
  CONFIG.RDATA_WIDTH 32 \
  CONFIG.READ_WATERMARK 0 \
  CONFIG.READ_WRITE_MODE READ_WRITE \
  CONFIG.SEP000_PROTOCOL AXI4 \
  CONFIG.SEP000_RDATA_WIDTH 32 \
  CONFIG.SEP000_WDATA_WIDTH 32 \
  CONFIG.SEP001_PROTOCOL AXI4LITE \
  CONFIG.SEP001_RDATA_WIDTH 32 \
  CONFIG.SEP001_WDATA_WIDTH 32 \
  CONFIG.SEP002_PROTOCOL AXI4LITE \
  CONFIG.SEP002_RDATA_WIDTH 32 \
  CONFIG.SEP002_WDATA_WIDTH 32 \
  CONFIG.SEP003_PROTOCOL AXI4LITE \
  CONFIG.SEP003_RDATA_WIDTH 32 \
  CONFIG.SEP003_WDATA_WIDTH 32 \
  CONFIG.SEP004_PROTOCOL AXI4LITE \
  CONFIG.SEP004_RDATA_WIDTH 32 \
  CONFIG.SEP004_WDATA_WIDTH 32 \
  CONFIG.SEP005_PROTOCOL AXI4LITE \
  CONFIG.SEP005_RDATA_WIDTH 32 \
  CONFIG.SEP005_WDATA_WIDTH 32 \
  CONFIG.SEP006_PROTOCOL AXI4LITE \
  CONFIG.SEP006_RDATA_WIDTH 32 \
  CONFIG.SEP006_WDATA_WIDTH 32 \
  CONFIG.SEP007_PROTOCOL AXI4LITE \
  CONFIG.SEP007_RDATA_WIDTH 32 \
  CONFIG.SEP007_WDATA_WIDTH 32 \
  CONFIG.SEP008_PROTOCOL AXI4LITE \
  CONFIG.SEP008_RDATA_WIDTH 32 \
  CONFIG.SEP008_WDATA_WIDTH 32 \
  CONFIG.SEP009_PROTOCOL AXI4LITE \
  CONFIG.SEP009_RDATA_WIDTH 32 \
  CONFIG.SEP009_WDATA_WIDTH 32 \
  CONFIG.SEP010_PROTOCOL AXI4LITE \
  CONFIG.SEP010_RDATA_WIDTH 32 \
  CONFIG.SEP010_WDATA_WIDTH 32 \
  CONFIG.SEP011_PROTOCOL AXI4LITE \
  CONFIG.SEP011_RDATA_WIDTH 32 \
  CONFIG.SEP011_WDATA_WIDTH 32 \
  CONFIG.SEP012_PROTOCOL AXI4LITE \
  CONFIG.SEP012_RDATA_WIDTH 32 \
  CONFIG.SEP012_WDATA_WIDTH 32 \
  CONFIG.SEP013_PROTOCOL AXI4LITE \
  CONFIG.SEP013_RDATA_WIDTH 32 \
  CONFIG.SEP013_WDATA_WIDTH 32 \
  CONFIG.SEP014_PROTOCOL AXI4LITE \
  CONFIG.SEP014_RDATA_WIDTH 32 \
  CONFIG.SEP014_WDATA_WIDTH 32 \
  CONFIG.SEP015_PROTOCOL AXI4LITE \
  CONFIG.SEP015_RDATA_WIDTH 32 \
  CONFIG.SEP015_WDATA_WIDTH 32 \
  CONFIG.SEP016_PROTOCOL AXI4LITE \
  CONFIG.SEP016_RDATA_WIDTH 32 \
  CONFIG.SEP016_WDATA_WIDTH 32 \
  CONFIG.SEP017_PROTOCOL AXI4LITE \
  CONFIG.SEP017_RDATA_WIDTH 32 \
  CONFIG.SEP017_WDATA_WIDTH 32 \
  CONFIG.SEP018_PROTOCOL AXI4LITE \
  CONFIG.SEP018_RDATA_WIDTH 32 \
  CONFIG.SEP018_WDATA_WIDTH 32 \
  CONFIG.SEP019_PROTOCOL AXI4LITE \
  CONFIG.SEP019_RDATA_WIDTH 32 \
  CONFIG.SEP019_WDATA_WIDTH 32 \
  CONFIG.SEP020_PROTOCOL AXI4LITE \
  CONFIG.SEP020_RDATA_WIDTH 32 \
  CONFIG.SEP020_WDATA_WIDTH 32 \
  CONFIG.SEP021_PROTOCOL AXI4LITE \
  CONFIG.SEP021_RDATA_WIDTH 32 \
  CONFIG.SEP021_WDATA_WIDTH 32 \
  CONFIG.SEP022_PROTOCOL AXI4LITE \
  CONFIG.SEP022_RDATA_WIDTH 32 \
  CONFIG.SEP022_WDATA_WIDTH 32 \
  CONFIG.SEP023_PROTOCOL AXI4LITE \
  CONFIG.SEP023_RDATA_WIDTH 32 \
  CONFIG.SEP023_WDATA_WIDTH 32 \
  CONFIG.SEP024_PROTOCOL AXI4LITE \
  CONFIG.SEP024_RDATA_WIDTH 32 \
  CONFIG.SEP024_WDATA_WIDTH 32 \
  CONFIG.SEP025_PROTOCOL AXI4LITE \
  CONFIG.SEP025_RDATA_WIDTH 32 \
  CONFIG.SEP025_WDATA_WIDTH 32 \
  CONFIG.SEP026_PROTOCOL AXI4LITE \
  CONFIG.SEP026_RDATA_WIDTH 32 \
  CONFIG.SEP026_WDATA_WIDTH 32 \
  CONFIG.SEP027_PROTOCOL AXI4LITE \
  CONFIG.SEP027_RDATA_WIDTH 32 \
  CONFIG.SEP027_WDATA_WIDTH 32 \
  CONFIG.SEP028_PROTOCOL AXI4LITE \
  CONFIG.SEP028_RDATA_WIDTH 32 \
  CONFIG.SEP028_WDATA_WIDTH 32 \
  CONFIG.SEP029_PROTOCOL AXI4LITE \
  CONFIG.SEP029_RDATA_WIDTH 32 \
  CONFIG.SEP029_WDATA_WIDTH 32 \
  CONFIG.SEP030_PROTOCOL AXI4LITE \
  CONFIG.SEP030_RDATA_WIDTH 32 \
  CONFIG.SEP030_WDATA_WIDTH 32 \
  CONFIG.SEP031_PROTOCOL AXI4LITE \
  CONFIG.SEP031_RDATA_WIDTH 32 \
  CONFIG.SEP031_WDATA_WIDTH 32 \
  CONFIG.SEP032_PROTOCOL AXI4LITE \
  CONFIG.SEP032_RDATA_WIDTH 32 \
  CONFIG.SEP032_WDATA_WIDTH 32 \
  CONFIG.SEP033_PROTOCOL AXI4LITE \
  CONFIG.SEP033_RDATA_WIDTH 32 \
  CONFIG.SEP033_WDATA_WIDTH 32 \
  CONFIG.SEP034_PROTOCOL AXI4LITE \
  CONFIG.SEP034_RDATA_WIDTH 32 \
  CONFIG.SEP034_WDATA_WIDTH 32 \
  CONFIG.SEP035_PROTOCOL AXI4LITE \
  CONFIG.SEP035_RDATA_WIDTH 32 \
  CONFIG.SEP035_WDATA_WIDTH 32 \
  CONFIG.SEP036_PROTOCOL AXI4LITE \
  CONFIG.SEP036_RDATA_WIDTH 32 \
  CONFIG.SEP036_WDATA_WIDTH 32 \
  CONFIG.SEP037_PROTOCOL AXI4LITE \
  CONFIG.SEP037_RDATA_WIDTH 32 \
  CONFIG.SEP037_WDATA_WIDTH 32 \
  CONFIG.SEP038_PROTOCOL AXI4LITE \
  CONFIG.SEP038_RDATA_WIDTH 32 \
  CONFIG.SEP038_WDATA_WIDTH 32 \
  CONFIG.SEP039_PROTOCOL AXI4LITE \
  CONFIG.SEP039_RDATA_WIDTH 32 \
  CONFIG.SEP039_WDATA_WIDTH 32 \
  CONFIG.SEP040_PROTOCOL AXI4 \
  CONFIG.SEP040_RDATA_WIDTH 32 \
  CONFIG.SEP040_WDATA_WIDTH 32 \
  CONFIG.SEP041_PROTOCOL AXI4 \
  CONFIG.SEP041_RDATA_WIDTH 32 \
  CONFIG.SEP041_WDATA_WIDTH 32 \
  CONFIG.SEP042_PROTOCOL AXI4 \
  CONFIG.SEP042_RDATA_WIDTH 32 \
  CONFIG.SEP042_WDATA_WIDTH 32 \
  CONFIG.SEP043_PROTOCOL AXI4 \
  CONFIG.SEP043_RDATA_WIDTH 32 \
  CONFIG.SEP043_WDATA_WIDTH 32 \
  CONFIG.SEP044_PROTOCOL AXI4 \
  CONFIG.SEP044_RDATA_WIDTH 32 \
  CONFIG.SEP044_WDATA_WIDTH 32 \
  CONFIG.SEP045_PROTOCOL AXI4 \
  CONFIG.SEP045_RDATA_WIDTH 32 \
  CONFIG.SEP045_WDATA_WIDTH 32 \
  CONFIG.SEP046_PROTOCOL AXI4 \
  CONFIG.SEP046_RDATA_WIDTH 32 \
  CONFIG.SEP046_WDATA_WIDTH 32 \
  CONFIG.SEP047_PROTOCOL AXI4 \
  CONFIG.SEP047_RDATA_WIDTH 32 \
  CONFIG.SEP047_WDATA_WIDTH 32 \
  CONFIG.SEP048_PROTOCOL AXI4 \
  CONFIG.SEP048_RDATA_WIDTH 32 \
  CONFIG.SEP048_WDATA_WIDTH 32 \
  CONFIG.SEP049_PROTOCOL AXI4 \
  CONFIG.SEP049_RDATA_WIDTH 32 \
  CONFIG.SEP049_WDATA_WIDTH 32 \
  CONFIG.SEP050_PROTOCOL AXI4 \
  CONFIG.SEP050_RDATA_WIDTH 32 \
  CONFIG.SEP050_WDATA_WIDTH 32 \
  CONFIG.SINGLE_ISSUING 1 \
  CONFIG.SUPPORTS_NARROW 1 \
  CONFIG.S_RUSER_BITS_PER_BYTE 0 \
  CONFIG.S_WUSER_BITS_PER_BYTE 0 \
  CONFIG.WDATA_WIDTH 32 \
  CONFIG.WRITE_WATERMARK 0 \
] [get_bd_cells s00_si_converter]

# ---- hierarchy /s00_nodes ----
current_bd_instance /s00_nodes
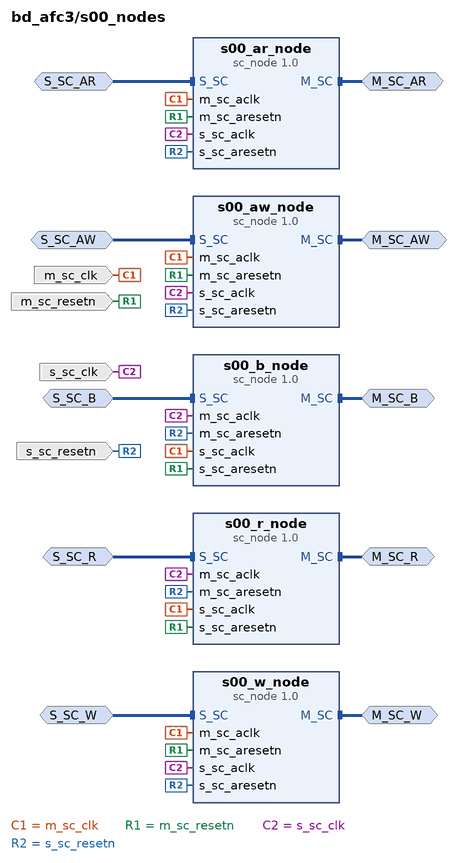
[diagram p31: block diagram inside /s00_nodes]
create_bd_intf_pin -mode Master -vlnv xilinx.com:interface:sc_rtl:1.0 M_SC_AR
create_bd_intf_pin -mode Slave -vlnv xilinx.com:interface:sc_rtl:1.0 S_SC_AR
create_bd_intf_pin -mode Master -vlnv xilinx.com:interface:sc_rtl:1.0 M_SC_R
create_bd_intf_pin -mode Slave -vlnv xilinx.com:interface:sc_rtl:1.0 S_SC_R
create_bd_intf_pin -mode Master -vlnv xilinx.com:interface:sc_rtl:1.0 M_SC_AW
create_bd_intf_pin -mode Slave -vlnv xilinx.com:interface:sc_rtl:1.0 S_SC_AW
create_bd_intf_pin -mode Master -vlnv xilinx.com:interface:sc_rtl:1.0 M_SC_W
create_bd_intf_pin -mode Slave -vlnv xilinx.com:interface:sc_rtl:1.0 S_SC_W
create_bd_intf_pin -mode Master -vlnv xilinx.com:interface:sc_rtl:1.0 M_SC_B
create_bd_intf_pin -mode Slave -vlnv xilinx.com:interface:sc_rtl:1.0 S_SC_B
create_bd_pin -dir I -type clk s_sc_clk
create_bd_pin -dir I -type rst s_sc_resetn
create_bd_pin -dir I -type clk m_sc_clk
create_bd_pin -dir I -type rst m_sc_resetn

create_bd_cell -type ip -vlnv xilinx.com:ip:sc_node:1.0 s00_ar_node
set_property -dict [list \
  CONFIG.ACLKEN_CONVERSION 0 \
  CONFIG.ACLK_RELATIONSHIP 1 \
  CONFIG.ADDR_WIDTH 40 \
  CONFIG.CHANNEL 2 \
  CONFIG.FIFO_TYPE 2 \
  CONFIG.ID_WIDTH 3 \
  CONFIG.M00_NUM_BYTES 4 \
  CONFIG.M01_NUM_BYTES 4 \
  CONFIG.M02_NUM_BYTES 4 \
  CONFIG.M03_NUM_BYTES 4 \
  CONFIG.M04_NUM_BYTES 4 \
  CONFIG.M05_NUM_BYTES 4 \
  CONFIG.M06_NUM_BYTES 4 \
  CONFIG.M07_NUM_BYTES 4 \
  CONFIG.M08_NUM_BYTES 4 \
  CONFIG.M09_NUM_BYTES 4 \
  CONFIG.M10_NUM_BYTES 4 \
  CONFIG.M11_NUM_BYTES 4 \
  CONFIG.M12_NUM_BYTES 4 \
  CONFIG.M13_NUM_BYTES 4 \
  CONFIG.M14_NUM_BYTES 4 \
  CONFIG.M15_NUM_BYTES 4 \
  CONFIG.MAX_PAYLD_BYTES 4 \
  CONFIG.NUM_MI 8 \
  CONFIG.NUM_OUTSTANDING 8 \
  CONFIG.NUM_SI 1 \
  CONFIG.PAYLD_WIDTH 182 \
  CONFIG.S00_NUM_BYTES 4 \
  CONFIG.S01_NUM_BYTES 4 \
  CONFIG.S02_NUM_BYTES 4 \
  CONFIG.S03_NUM_BYTES 4 \
  CONFIG.S04_NUM_BYTES 4 \
  CONFIG.S05_NUM_BYTES 4 \
  CONFIG.S06_NUM_BYTES 4 \
  CONFIG.S07_NUM_BYTES 4 \
  CONFIG.S08_NUM_BYTES 4 \
  CONFIG.S09_NUM_BYTES 4 \
  CONFIG.S10_NUM_BYTES 4 \
  CONFIG.S11_NUM_BYTES 4 \
  CONFIG.S12_NUM_BYTES 4 \
  CONFIG.S13_NUM_BYTES 4 \
  CONFIG.S14_NUM_BYTES 4 \
  CONFIG.S15_NUM_BYTES 4 \
  CONFIG.SC_ROUTE_WIDTH 16 \
  CONFIG.USER_WIDTH 16 \
] [get_bd_cells s00_ar_node]
create_bd_cell -type ip -vlnv xilinx.com:ip:sc_node:1.0 s00_r_node
set_property -dict [list \
  CONFIG.ACLKEN_CONVERSION 0 \
  CONFIG.ACLK_RELATIONSHIP 1 \
  CONFIG.ADDR_WIDTH 40 \
  CONFIG.CHANNEL 0 \
  CONFIG.FIFO_TYPE 2 \
  CONFIG.ID_WIDTH 3 \
  CONFIG.M00_NUM_BYTES 4 \
  CONFIG.M01_NUM_BYTES 4 \
  CONFIG.M02_NUM_BYTES 4 \
  CONFIG.M03_NUM_BYTES 4 \
  CONFIG.M04_NUM_BYTES 4 \
  CONFIG.M05_NUM_BYTES 4 \
  CONFIG.M06_NUM_BYTES 4 \
  CONFIG.M07_NUM_BYTES 4 \
  CONFIG.M08_NUM_BYTES 4 \
  CONFIG.M09_NUM_BYTES 4 \
  CONFIG.M10_NUM_BYTES 4 \
  CONFIG.M11_NUM_BYTES 4 \
  CONFIG.M12_NUM_BYTES 4 \
  CONFIG.M13_NUM_BYTES 4 \
  CONFIG.M14_NUM_BYTES 4 \
  CONFIG.M15_NUM_BYTES 4 \
  CONFIG.MAX_PAYLD_BYTES 4 \
  CONFIG.M_SEND_PIPELINE 0 \
  CONFIG.NUM_MI 1 \
  CONFIG.NUM_OUTSTANDING 8 \
  CONFIG.NUM_SI 8 \
  CONFIG.PAYLD_WIDTH 55 \
  CONFIG.S00_NUM_BYTES 4 \
  CONFIG.S01_NUM_BYTES 4 \
  CONFIG.S02_NUM_BYTES 4 \
  CONFIG.S03_NUM_BYTES 4 \
  CONFIG.S04_NUM_BYTES 4 \
  CONFIG.S05_NUM_BYTES 4 \
  CONFIG.S06_NUM_BYTES 4 \
  CONFIG.S07_NUM_BYTES 4 \
  CONFIG.S08_NUM_BYTES 4 \
  CONFIG.S09_NUM_BYTES 4 \
  CONFIG.S10_NUM_BYTES 4 \
  CONFIG.S11_NUM_BYTES 4 \
  CONFIG.S12_NUM_BYTES 4 \
  CONFIG.S13_NUM_BYTES 4 \
  CONFIG.S14_NUM_BYTES 4 \
  CONFIG.S15_NUM_BYTES 4 \
  CONFIG.SC_ROUTE_WIDTH 3 \
  CONFIG.USER_BITS_PER_BYTE 0 \
] [get_bd_cells s00_r_node]
create_bd_cell -type ip -vlnv xilinx.com:ip:sc_node:1.0 s00_aw_node
set_property -dict [list \
  CONFIG.ACLKEN_CONVERSION 0 \
  CONFIG.ACLK_RELATIONSHIP 1 \
  CONFIG.ADDR_WIDTH 40 \
  CONFIG.CHANNEL 3 \
  CONFIG.FIFO_TYPE 2 \
  CONFIG.ID_WIDTH 3 \
  CONFIG.M00_NUM_BYTES 4 \
  CONFIG.M01_NUM_BYTES 4 \
  CONFIG.M02_NUM_BYTES 4 \
  CONFIG.M03_NUM_BYTES 4 \
  CONFIG.M04_NUM_BYTES 4 \
  CONFIG.M05_NUM_BYTES 4 \
  CONFIG.M06_NUM_BYTES 4 \
  CONFIG.M07_NUM_BYTES 4 \
  CONFIG.M08_NUM_BYTES 4 \
  CONFIG.M09_NUM_BYTES 4 \
  CONFIG.M10_NUM_BYTES 4 \
  CONFIG.M11_NUM_BYTES 4 \
  CONFIG.M12_NUM_BYTES 4 \
  CONFIG.M13_NUM_BYTES 4 \
  CONFIG.M14_NUM_BYTES 4 \
  CONFIG.M15_NUM_BYTES 4 \
  CONFIG.MAX_PAYLD_BYTES 4 \
  CONFIG.NUM_MI 8 \
  CONFIG.NUM_OUTSTANDING 8 \
  CONFIG.NUM_SI 1 \
  CONFIG.PAYLD_WIDTH 182 \
  CONFIG.S00_NUM_BYTES 4 \
  CONFIG.S01_NUM_BYTES 4 \
  CONFIG.S02_NUM_BYTES 4 \
  CONFIG.S03_NUM_BYTES 4 \
  CONFIG.S04_NUM_BYTES 4 \
  CONFIG.S05_NUM_BYTES 4 \
  CONFIG.S06_NUM_BYTES 4 \
  CONFIG.S07_NUM_BYTES 4 \
  CONFIG.S08_NUM_BYTES 4 \
  CONFIG.S09_NUM_BYTES 4 \
  CONFIG.S10_NUM_BYTES 4 \
  CONFIG.S11_NUM_BYTES 4 \
  CONFIG.S12_NUM_BYTES 4 \
  CONFIG.S13_NUM_BYTES 4 \
  CONFIG.S14_NUM_BYTES 4 \
  CONFIG.S15_NUM_BYTES 4 \
  CONFIG.SC_ROUTE_WIDTH 16 \
  CONFIG.USER_WIDTH 16 \
] [get_bd_cells s00_aw_node]
create_bd_cell -type ip -vlnv xilinx.com:ip:sc_node:1.0 s00_w_node
set_property -dict [list \
  CONFIG.ACLKEN_CONVERSION 0 \
  CONFIG.ACLK_RELATIONSHIP 1 \
  CONFIG.ADDR_WIDTH 40 \
  CONFIG.CHANNEL 1 \
  CONFIG.FIFO_TYPE 2 \
  CONFIG.ID_WIDTH 3 \
  CONFIG.M00_NUM_BYTES 4 \
  CONFIG.M01_NUM_BYTES 4 \
  CONFIG.M02_NUM_BYTES 4 \
  CONFIG.M03_NUM_BYTES 4 \
  CONFIG.M04_NUM_BYTES 4 \
  CONFIG.M05_NUM_BYTES 4 \
  CONFIG.M06_NUM_BYTES 4 \
  CONFIG.M07_NUM_BYTES 4 \
  CONFIG.M08_NUM_BYTES 4 \
  CONFIG.M09_NUM_BYTES 4 \
  CONFIG.M10_NUM_BYTES 4 \
  CONFIG.M11_NUM_BYTES 4 \
  CONFIG.M12_NUM_BYTES 4 \
  CONFIG.M13_NUM_BYTES 4 \
  CONFIG.M14_NUM_BYTES 4 \
  CONFIG.M15_NUM_BYTES 4 \
  CONFIG.MAX_PAYLD_BYTES 4 \
  CONFIG.NUM_MI 8 \
  CONFIG.NUM_OUTSTANDING 8 \
  CONFIG.NUM_SI 1 \
  CONFIG.PAYLD_WIDTH 69 \
  CONFIG.S00_NUM_BYTES 4 \
  CONFIG.S01_NUM_BYTES 4 \
  CONFIG.S02_NUM_BYTES 4 \
  CONFIG.S03_NUM_BYTES 4 \
  CONFIG.S04_NUM_BYTES 4 \
  CONFIG.S05_NUM_BYTES 4 \
  CONFIG.S06_NUM_BYTES 4 \
  CONFIG.S07_NUM_BYTES 4 \
  CONFIG.S08_NUM_BYTES 4 \
  CONFIG.S09_NUM_BYTES 4 \
  CONFIG.S10_NUM_BYTES 4 \
  CONFIG.S11_NUM_BYTES 4 \
  CONFIG.S12_NUM_BYTES 4 \
  CONFIG.S13_NUM_BYTES 4 \
  CONFIG.S14_NUM_BYTES 4 \
  CONFIG.S15_NUM_BYTES 4 \
  CONFIG.SC_ROUTE_WIDTH 16 \
  CONFIG.USER_BITS_PER_BYTE 0 \
] [get_bd_cells s00_w_node]
create_bd_cell -type ip -vlnv xilinx.com:ip:sc_node:1.0 s00_b_node
set_property -dict [list \
  CONFIG.ACLKEN_CONVERSION 0 \
  CONFIG.ACLK_RELATIONSHIP 1 \
  CONFIG.ADDR_WIDTH 40 \
  CONFIG.CHANNEL 4 \
  CONFIG.FIFO_TYPE 2 \
  CONFIG.ID_WIDTH 3 \
  CONFIG.M00_NUM_BYTES 4 \
  CONFIG.M01_NUM_BYTES 4 \
  CONFIG.M02_NUM_BYTES 4 \
  CONFIG.M03_NUM_BYTES 4 \
  CONFIG.M04_NUM_BYTES 4 \
  CONFIG.M05_NUM_BYTES 4 \
  CONFIG.M06_NUM_BYTES 4 \
  CONFIG.M07_NUM_BYTES 4 \
  CONFIG.M08_NUM_BYTES 4 \
  CONFIG.M09_NUM_BYTES 4 \
  CONFIG.M10_NUM_BYTES 4 \
  CONFIG.M11_NUM_BYTES 4 \
  CONFIG.M12_NUM_BYTES 4 \
  CONFIG.M13_NUM_BYTES 4 \
  CONFIG.M14_NUM_BYTES 4 \
  CONFIG.M15_NUM_BYTES 4 \
  CONFIG.MAX_PAYLD_BYTES 4 \
  CONFIG.M_SEND_PIPELINE 0 \
  CONFIG.NUM_MI 1 \
  CONFIG.NUM_OUTSTANDING 8 \
  CONFIG.NUM_SI 8 \
  CONFIG.PAYLD_WIDTH 9 \
  CONFIG.S00_NUM_BYTES 4 \
  CONFIG.S01_NUM_BYTES 4 \
  CONFIG.S02_NUM_BYTES 4 \
  CONFIG.S03_NUM_BYTES 4 \
  CONFIG.S04_NUM_BYTES 4 \
  CONFIG.S05_NUM_BYTES 4 \
  CONFIG.S06_NUM_BYTES 4 \
  CONFIG.S07_NUM_BYTES 4 \
  CONFIG.S08_NUM_BYTES 4 \
  CONFIG.S09_NUM_BYTES 4 \
  CONFIG.S10_NUM_BYTES 4 \
  CONFIG.S11_NUM_BYTES 4 \
  CONFIG.S12_NUM_BYTES 4 \
  CONFIG.S13_NUM_BYTES 4 \
  CONFIG.S14_NUM_BYTES 4 \
  CONFIG.S15_NUM_BYTES 4 \
  CONFIG.SC_ROUTE_WIDTH 3 \
  CONFIG.USER_WIDTH 0 \
] [get_bd_cells s00_b_node]

# ---- hierarchy /m00_nodes ----
current_bd_instance /m00_nodes
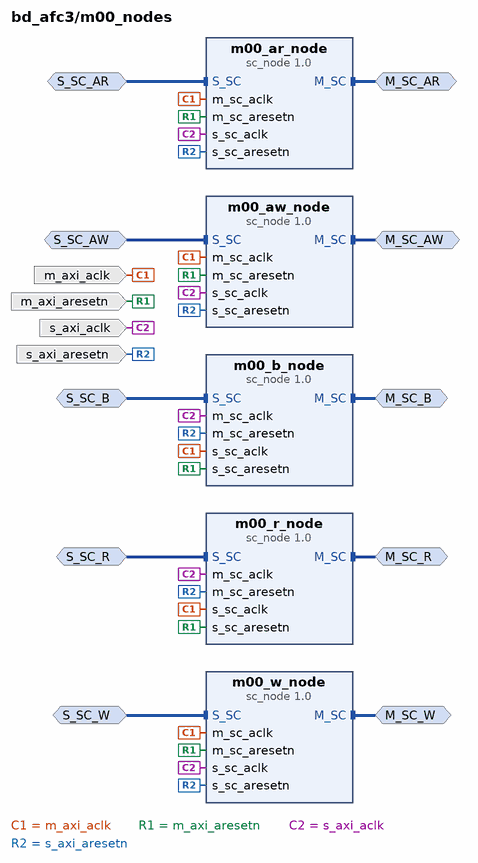
[diagram p32: block diagram inside /m00_nodes]
create_bd_intf_pin -mode Master -vlnv xilinx.com:interface:sc_rtl:1.0 M_SC_AR
create_bd_intf_pin -mode Slave -vlnv xilinx.com:interface:sc_rtl:1.0 S_SC_AR
create_bd_intf_pin -mode Master -vlnv xilinx.com:interface:sc_rtl:1.0 M_SC_R
create_bd_intf_pin -mode Slave -vlnv xilinx.com:interface:sc_rtl:1.0 S_SC_R
create_bd_intf_pin -mode Master -vlnv xilinx.com:interface:sc_rtl:1.0 M_SC_AW
create_bd_intf_pin -mode Slave -vlnv xilinx.com:interface:sc_rtl:1.0 S_SC_AW
create_bd_intf_pin -mode Master -vlnv xilinx.com:interface:sc_rtl:1.0 M_SC_W
create_bd_intf_pin -mode Slave -vlnv xilinx.com:interface:sc_rtl:1.0 S_SC_W
create_bd_intf_pin -mode Master -vlnv xilinx.com:interface:sc_rtl:1.0 M_SC_B
create_bd_intf_pin -mode Slave -vlnv xilinx.com:interface:sc_rtl:1.0 S_SC_B
create_bd_pin -dir I -type clk s_axi_aclk
create_bd_pin -dir I -type rst s_axi_aresetn
create_bd_pin -dir I -type clk m_axi_aclk
create_bd_pin -dir I -type rst m_axi_aresetn

create_bd_cell -type ip -vlnv xilinx.com:ip:sc_node:1.0 m00_ar_node
set_property -dict [list \
  CONFIG.ACLK_RELATIONSHIP 1 \
  CONFIG.ADDR_WIDTH 40 \
  CONFIG.CHANNEL 2 \
  CONFIG.FIFO_TYPE 2 \
  CONFIG.ID_WIDTH 3 \
  CONFIG.M00_NUM_BYTES 4 \
  CONFIG.M01_NUM_BYTES 4 \
  CONFIG.M02_NUM_BYTES 4 \
  CONFIG.M03_NUM_BYTES 4 \
  CONFIG.M04_NUM_BYTES 4 \
  CONFIG.M05_NUM_BYTES 4 \
  CONFIG.M06_NUM_BYTES 4 \
  CONFIG.M07_NUM_BYTES 4 \
  CONFIG.M08_NUM_BYTES 4 \
  CONFIG.M09_NUM_BYTES 4 \
  CONFIG.M10_NUM_BYTES 4 \
  CONFIG.M11_NUM_BYTES 4 \
  CONFIG.M12_NUM_BYTES 4 \
  CONFIG.M13_NUM_BYTES 4 \
  CONFIG.M14_NUM_BYTES 4 \
  CONFIG.M15_NUM_BYTES 4 \
  CONFIG.MAX_PAYLD_BYTES 4 \
  CONFIG.M_SEND_PIPELINE 0 \
  CONFIG.NUM_MI 1 \
  CONFIG.NUM_OUTSTANDING 8 \
  CONFIG.NUM_SI 1 \
  CONFIG.PAYLD_WIDTH 182 \
  CONFIG.S00_NUM_BYTES 4 \
  CONFIG.S01_NUM_BYTES 4 \
  CONFIG.S02_NUM_BYTES 4 \
  CONFIG.S03_NUM_BYTES 4 \
  CONFIG.S04_NUM_BYTES 4 \
  CONFIG.S05_NUM_BYTES 4 \
  CONFIG.S06_NUM_BYTES 4 \
  CONFIG.S07_NUM_BYTES 4 \
  CONFIG.S08_NUM_BYTES 4 \
  CONFIG.S09_NUM_BYTES 4 \
  CONFIG.S10_NUM_BYTES 4 \
  CONFIG.S11_NUM_BYTES 4 \
  CONFIG.S12_NUM_BYTES 4 \
  CONFIG.S13_NUM_BYTES 4 \
  CONFIG.S14_NUM_BYTES 4 \
  CONFIG.S15_NUM_BYTES 4 \
  CONFIG.SC_ROUTE_WIDTH 16 \
  CONFIG.USER_WIDTH 16 \
] [get_bd_cells m00_ar_node]
create_bd_cell -type ip -vlnv xilinx.com:ip:sc_node:1.0 m00_r_node
set_property -dict [list \
  CONFIG.ACLK_RELATIONSHIP 1 \
  CONFIG.ADDR_WIDTH 40 \
  CONFIG.CHANNEL 0 \
  CONFIG.FIFO_TYPE 2 \
  CONFIG.ID_WIDTH 3 \
  CONFIG.M00_NUM_BYTES 4 \
  CONFIG.M01_NUM_BYTES 4 \
  CONFIG.M02_NUM_BYTES 4 \
  CONFIG.M03_NUM_BYTES 4 \
  CONFIG.M04_NUM_BYTES 4 \
  CONFIG.M05_NUM_BYTES 4 \
  CONFIG.M06_NUM_BYTES 4 \
  CONFIG.M07_NUM_BYTES 4 \
  CONFIG.M08_NUM_BYTES 4 \
  CONFIG.M09_NUM_BYTES 4 \
  CONFIG.M10_NUM_BYTES 4 \
  CONFIG.M11_NUM_BYTES 4 \
  CONFIG.M12_NUM_BYTES 4 \
  CONFIG.M13_NUM_BYTES 4 \
  CONFIG.M14_NUM_BYTES 4 \
  CONFIG.M15_NUM_BYTES 4 \
  CONFIG.MAX_PAYLD_BYTES 4 \
  CONFIG.NUM_MI 1 \
  CONFIG.NUM_OUTSTANDING 8 \
  CONFIG.NUM_SI 1 \
  CONFIG.PAYLD_WIDTH 55 \
  CONFIG.S00_NUM_BYTES 4 \
  CONFIG.S01_NUM_BYTES 4 \
  CONFIG.S02_NUM_BYTES 4 \
  CONFIG.S03_NUM_BYTES 4 \
  CONFIG.S04_NUM_BYTES 4 \
  CONFIG.S05_NUM_BYTES 4 \
  CONFIG.S06_NUM_BYTES 4 \
  CONFIG.S07_NUM_BYTES 4 \
  CONFIG.S08_NUM_BYTES 4 \
  CONFIG.S09_NUM_BYTES 4 \
  CONFIG.S10_NUM_BYTES 4 \
  CONFIG.S11_NUM_BYTES 4 \
  CONFIG.S12_NUM_BYTES 4 \
  CONFIG.S13_NUM_BYTES 4 \
  CONFIG.S14_NUM_BYTES 4 \
  CONFIG.S15_NUM_BYTES 4 \
  CONFIG.SC_ROUTE_WIDTH 3 \
  CONFIG.USER_BITS_PER_BYTE 0 \
  CONFIG.USER_WIDTH 0 \
] [get_bd_cells m00_r_node]
create_bd_cell -type ip -vlnv xilinx.com:ip:sc_node:1.0 m00_aw_node
set_property -dict [list \
  CONFIG.ACLK_RELATIONSHIP 1 \
  CONFIG.ADDR_WIDTH 40 \
  CONFIG.CHANNEL 3 \
  CONFIG.FIFO_TYPE 2 \
  CONFIG.ID_WIDTH 3 \
  CONFIG.M00_NUM_BYTES 4 \
  CONFIG.M01_NUM_BYTES 4 \
  CONFIG.M02_NUM_BYTES 4 \
  CONFIG.M03_NUM_BYTES 4 \
  CONFIG.M04_NUM_BYTES 4 \
  CONFIG.M05_NUM_BYTES 4 \
  CONFIG.M06_NUM_BYTES 4 \
  CONFIG.M07_NUM_BYTES 4 \
  CONFIG.M08_NUM_BYTES 4 \
  CONFIG.M09_NUM_BYTES 4 \
  CONFIG.M10_NUM_BYTES 4 \
  CONFIG.M11_NUM_BYTES 4 \
  CONFIG.M12_NUM_BYTES 4 \
  CONFIG.M13_NUM_BYTES 4 \
  CONFIG.M14_NUM_BYTES 4 \
  CONFIG.M15_NUM_BYTES 4 \
  CONFIG.MAX_PAYLD_BYTES 4 \
  CONFIG.M_SEND_PIPELINE 0 \
  CONFIG.NUM_MI 1 \
  CONFIG.NUM_OUTSTANDING 8 \
  CONFIG.NUM_SI 1 \
  CONFIG.PAYLD_WIDTH 182 \
  CONFIG.S00_NUM_BYTES 4 \
  CONFIG.S01_NUM_BYTES 4 \
  CONFIG.S02_NUM_BYTES 4 \
  CONFIG.S03_NUM_BYTES 4 \
  CONFIG.S04_NUM_BYTES 4 \
  CONFIG.S05_NUM_BYTES 4 \
  CONFIG.S06_NUM_BYTES 4 \
  CONFIG.S07_NUM_BYTES 4 \
  CONFIG.S08_NUM_BYTES 4 \
  CONFIG.S09_NUM_BYTES 4 \
  CONFIG.S10_NUM_BYTES 4 \
  CONFIG.S11_NUM_BYTES 4 \
  CONFIG.S12_NUM_BYTES 4 \
  CONFIG.S13_NUM_BYTES 4 \
  CONFIG.S14_NUM_BYTES 4 \
  CONFIG.S15_NUM_BYTES 4 \
  CONFIG.SC_ROUTE_WIDTH 16 \
  CONFIG.USER_WIDTH 16 \
] [get_bd_cells m00_aw_node]
create_bd_cell -type ip -vlnv xilinx.com:ip:sc_node:1.0 m00_w_node
set_property -dict [list \
  CONFIG.ACLK_RELATIONSHIP 1 \
  CONFIG.ADDR_WIDTH 40 \
  CONFIG.CHANNEL 1 \
  CONFIG.FIFO_TYPE 2 \
  CONFIG.ID_WIDTH 3 \
  CONFIG.M00_NUM_BYTES 4 \
  CONFIG.M01_NUM_BYTES 4 \
  CONFIG.M02_NUM_BYTES 4 \
  CONFIG.M03_NUM_BYTES 4 \
  CONFIG.M04_NUM_BYTES 4 \
  CONFIG.M05_NUM_BYTES 4 \
  CONFIG.M06_NUM_BYTES 4 \
  CONFIG.M07_NUM_BYTES 4 \
  CONFIG.M08_NUM_BYTES 4 \
  CONFIG.M09_NUM_BYTES 4 \
  CONFIG.M10_NUM_BYTES 4 \
  CONFIG.M11_NUM_BYTES 4 \
  CONFIG.M12_NUM_BYTES 4 \
  CONFIG.M13_NUM_BYTES 4 \
  CONFIG.M14_NUM_BYTES 4 \
  CONFIG.M15_NUM_BYTES 4 \
  CONFIG.MAX_PAYLD_BYTES 4 \
  CONFIG.M_SEND_PIPELINE 0 \
  CONFIG.NUM_MI 1 \
  CONFIG.NUM_OUTSTANDING 8 \
  CONFIG.NUM_SI 1 \
  CONFIG.PAYLD_WIDTH 69 \
  CONFIG.S00_NUM_BYTES 4 \
  CONFIG.S01_NUM_BYTES 4 \
  CONFIG.S02_NUM_BYTES 4 \
  CONFIG.S03_NUM_BYTES 4 \
  CONFIG.S04_NUM_BYTES 4 \
  CONFIG.S05_NUM_BYTES 4 \
  CONFIG.S06_NUM_BYTES 4 \
  CONFIG.S07_NUM_BYTES 4 \
  CONFIG.S08_NUM_BYTES 4 \
  CONFIG.S09_NUM_BYTES 4 \
  CONFIG.S10_NUM_BYTES 4 \
  CONFIG.S11_NUM_BYTES 4 \
  CONFIG.S12_NUM_BYTES 4 \
  CONFIG.S13_NUM_BYTES 4 \
  CONFIG.S14_NUM_BYTES 4 \
  CONFIG.S15_NUM_BYTES 4 \
  CONFIG.SC_ROUTE_WIDTH 16 \
  CONFIG.USER_BITS_PER_BYTE 0 \
  CONFIG.USER_WIDTH 0 \
] [get_bd_cells m00_w_node]
create_bd_cell -type ip -vlnv xilinx.com:ip:sc_node:1.0 m00_b_node
set_property -dict [list \
  CONFIG.ACLK_RELATIONSHIP 1 \
  CONFIG.ADDR_WIDTH 40 \
  CONFIG.CHANNEL 4 \
  CONFIG.FIFO_TYPE 2 \
  CONFIG.ID_WIDTH 3 \
  CONFIG.M00_NUM_BYTES 4 \
  CONFIG.M01_NUM_BYTES 4 \
  CONFIG.M02_NUM_BYTES 4 \
  CONFIG.M03_NUM_BYTES 4 \
  CONFIG.M04_NUM_BYTES 4 \
  CONFIG.M05_NUM_BYTES 4 \
  CONFIG.M06_NUM_BYTES 4 \
  CONFIG.M07_NUM_BYTES 4 \
  CONFIG.M08_NUM_BYTES 4 \
  CONFIG.M09_NUM_BYTES 4 \
  CONFIG.M10_NUM_BYTES 4 \
  CONFIG.M11_NUM_BYTES 4 \
  CONFIG.M12_NUM_BYTES 4 \
  CONFIG.M13_NUM_BYTES 4 \
  CONFIG.M14_NUM_BYTES 4 \
  CONFIG.M15_NUM_BYTES 4 \
  CONFIG.MAX_PAYLD_BYTES 4 \
  CONFIG.NUM_MI 1 \
  CONFIG.NUM_OUTSTANDING 8 \
  CONFIG.NUM_SI 1 \
  CONFIG.PAYLD_WIDTH 9 \
  CONFIG.S00_NUM_BYTES 4 \
  CONFIG.S01_NUM_BYTES 4 \
  CONFIG.S02_NUM_BYTES 4 \
  CONFIG.S03_NUM_BYTES 4 \
  CONFIG.S04_NUM_BYTES 4 \
  CONFIG.S05_NUM_BYTES 4 \
  CONFIG.S06_NUM_BYTES 4 \
  CONFIG.S07_NUM_BYTES 4 \
  CONFIG.S08_NUM_BYTES 4 \
  CONFIG.S09_NUM_BYTES 4 \
  CONFIG.S10_NUM_BYTES 4 \
  CONFIG.S11_NUM_BYTES 4 \
  CONFIG.S12_NUM_BYTES 4 \
  CONFIG.S13_NUM_BYTES 4 \
  CONFIG.S14_NUM_BYTES 4 \
  CONFIG.S15_NUM_BYTES 4 \
  CONFIG.SC_ROUTE_WIDTH 3 \
  CONFIG.USER_WIDTH 0 \
] [get_bd_cells m00_b_node]
